# EAGLE design buffered mult rt1_postpwer (EAGLE 7.3.0)

## Sheet 1 of 2
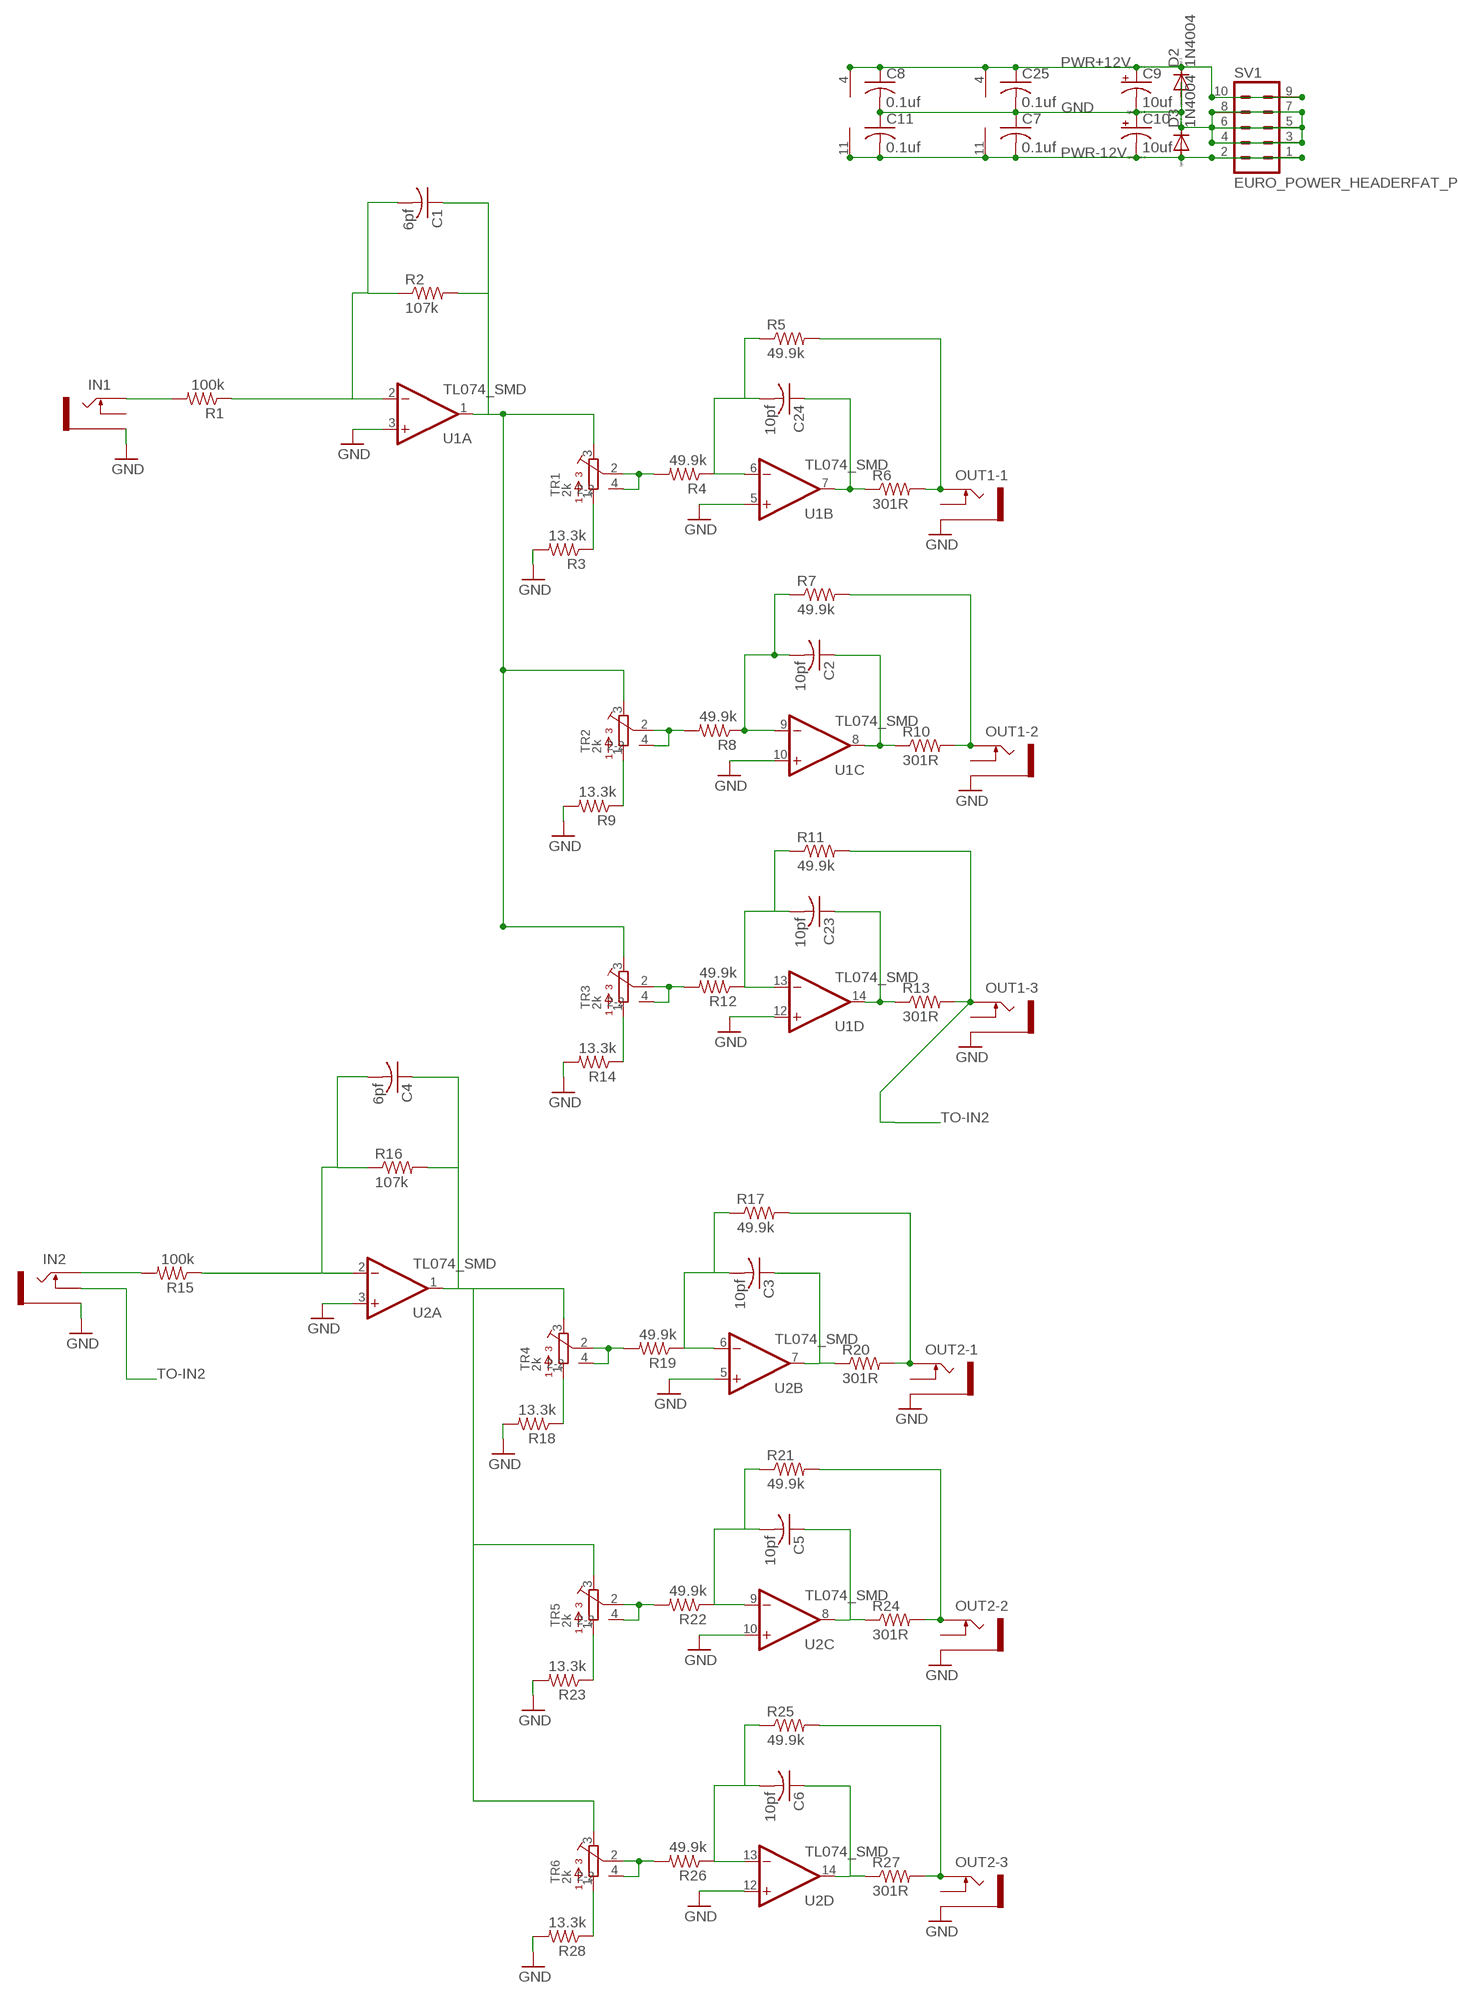
[diagram p0: schematic, sheet 1]

### Parts
C1  6pf  C-USC0603  [C0603]
C2  10pf  C-USC0603  [C0603]
C3  10pf  C-USC0603  [C0603]
C4  6pf  C-USC0603  [C0603]
C5  10pf  C-USC0603  [C0603]
C6  10pf  C-USC0603  [C0603]
C7  0.1uf  C-USC0603  [C0603]
C8  0.1uf  C-USC0603  [C0603]
C9  10uf  CPOL-US153CLV-0505  [153CLV-0505]
C10  10uf  CPOL-US153CLV-0505  [153CLV-0505]
C11  0.1uf  C-USC0603  [C0603]
C23  10pf  C-USC0603  [C0603]
C24  10pf  C-USC0603  [C0603]
C25  0.1uf  C-USC0603  [C0603]
D2  1N4004  [DO41-10]
D3  1N4004  [DO41-10]
IN1  THONKICONNNEW  [WQP-PJ301M-12_JACK]
IN2  THONKICONNNEW  [WQP-PJ301M-12_JACK]
OUT1-1  THONKICONNNEW  [WQP-PJ301M-12_JACK]
OUT1-2  THONKICONNNEW  [WQP-PJ301M-12_JACK]
OUT1-3  THONKICONNNEW  [WQP-PJ301M-12_JACK]
OUT2-1  THONKICONNNEW  [WQP-PJ301M-12_JACK]
OUT2-2  THONKICONNNEW  [WQP-PJ301M-12_JACK]
OUT2-3  THONKICONNNEW  [WQP-PJ301M-12_JACK]
R1  100k  R-US_R0603  [R0603]
R2  107k  R-US_R0603  [R0603]
R3  13.3k  R-US_R0603  [R0603]
R4  49.9k  R-US_R0603  [R0603]
R5  49.9k  R-US_R0603  [R0603]
R6  301R  R-US_R0603  [R0603]
R7  49.9k  R-US_R0603  [R0603]
R8  49.9k  R-US_R0603  [R0603]
R9  13.3k  R-US_R0603  [R0603]
R10  301R  R-US_R0603  [R0603]
R11  49.9k  R-US_R0603  [R0603]
R12  49.9k  R-US_R0603  [R0603]
R13  301R  R-US_R0603  [R0603]
R14  13.3k  R-US_R0603  [R0603]
R15  100k  R-US_R0603  [R0603]
R16  107k  R-US_R0603  [R0603]
R17  49.9k  R-US_R0603  [R0603]
R18  13.3k  R-US_R0603  [R0603]
R19  49.9k  R-US_R0603  [R0603]
R20  301R  R-US_R0603  [R0603]
R21  49.9k  R-US_R0603  [R0603]
R22  49.9k  R-US_R0603  [R0603]
R23  13.3k  R-US_R0603  [R0603]
R24  301R  R-US_R0603  [R0603]
R25  49.9k  R-US_R0603  [R0603]
R26  49.9k  R-US_R0603  [R0603]
R27  301R  R-US_R0603  [R0603]
R28  13.3k  R-US_R0603  [R0603]
SV1  EURO_POWER_HEADERFAT_PADS  [EURO_PWR_HEADER_FAT]
TR1  2k  BOURNS_3362P_TRIMMERP  [BOURNS_3362P_TRIMMER]
TR2  2k  BOURNS_3362P_TRIMMERP  [BOURNS_3362P_TRIMMER]
TR3  2k  BOURNS_3362P_TRIMMERP  [BOURNS_3362P_TRIMMER]
TR4  2k  BOURNS_3362P_TRIMMERP  [BOURNS_3362P_TRIMMER]
TR5  2k  BOURNS_3362P_TRIMMERP  [BOURNS_3362P_TRIMMER]
TR6  2k  BOURNS_3362P_TRIMMERP  [BOURNS_3362P_TRIMMER]
U1  TL074_SMD  [SO14]
U2  TL074_SMD  [SO14]

### Nets
GND: C7.1 C8.2 C9.- C10.+ C11.1 C25.2 D2.A D3.C IN1.P$3_SLEEVE(SLEEVE) IN2.P$3_SLEEVE(SLEEVE) OUT1-1.P$3_SLEEVE(SLEEVE) OUT1-2.P$3_SLEEVE(SLEEVE) OUT1-3.P$3_SLEEVE(SLEEVE) OUT2-1.P$3_SLEEVE(SLEEVE) OUT2-2.P$3_SLEEVE(SLEEVE) OUT2-3.P$3_SLEEVE(SLEEVE) R3.2 R9.2 R14.2 R18.2 R23.2 R28.2 SV1.3 SV1.4 SV1.5 SV1.6 SV1.7 SV1.8 U1.3(A:+IN) U1.5(B:+IN) U1.10(C:+IN) U1.12(D:+IN) U2.3(A:+IN) U2.5(B:+IN) U2.10(C:+IN) U2.12(D:+IN)
N$1: IN1.P$1_TIP(TIP) R1.2
N$2: C4.1 R16.2 TR4.3 TR5.3 TR6.3 U2.1(A:OUT)
N$3: C1.2 R1.1 R2.1 U1.2(A:-IN)
N$4: C4.2 R15.1 R16.1 U2.2(A:-IN)
N$5: R18.1 TR4.1
N$6: R3.1 TR1.1
N$7: C1.1 R2.2 TR1.3 TR2.3 TR3.3 U1.1(A:OUT)
N$8: R19.2 TR4.2 TR4.4(2-2)
N$9: R4.2 TR1.2 TR1.4(2-2)
N$10: C24.2 R4.1 R5.1 U1.6(B:-IN)
N$11: C3.2 R17.1 R19.1 U2.6(B:-IN)
N$12: C24.1 R6.1 U1.7(B:OUT)
N$13: OUT1-1.P$1_TIP(TIP) R5.2 R6.2
N$14: C3.1 R20.1 U2.7(B:OUT)
N$15: R9.1 TR2.1
N$16: OUT2-1.P$1_TIP(TIP) R17.2 R20.2
N$17: R23.1 TR5.1
N$18: R22.2 TR5.2 TR5.4(2-2)
N$19: R8.2 TR2.2 TR2.4(2-2)
N$20: C2.2 R7.1 R8.1 U1.9(C:-IN)
N$21: C2.1 R10.1 U1.8(C:OUT)
N$23: C5.2 R21.1 R22.1 U2.9(C:-IN)
N$24: C5.1 R24.1 U2.8(C:OUT)
N$25: OUT1-2.P$1_TIP(TIP) R7.2 R10.2
N$26: OUT2-2.P$1_TIP(TIP) R21.2 R24.2
N$27: R28.1 TR6.1
N$28: R26.2 TR6.2 TR6.4(2-2)
N$29: C6.2 R25.1 R26.1 U2.13(D:-IN)
N$30: C6.1 R27.1 U2.14(D:OUT)
N$31: OUT2-3.P$1_TIP(TIP) R25.2 R27.2
N$41: R14.1 TR3.1
N$42: R12.2 TR3.2 TR3.4(2-2)
N$43: C23.2 R11.1 R12.1 U1.13(D:-IN)
PWR+12V: C8.1 C9.+ C25.1 D2.C SV1.9 SV1.10 U1.4(P:V+) U2.4(P:V+)
PWR-12V: C7.2 C10.- C11.2 D3.A SV1.1 SV1.2 U1.11(P:V-) U2.11(P:V-)
TO-IN2: C23.1 IN2.P$2_SWITCH(SWITCH) OUT1-3.P$1_TIP(TIP) R11.2 R13.1 R13.2 U1.14(D:OUT)
TO-IN3: IN2.P$1_TIP(TIP) R15.2
Unconnected: IN1.P$2_SWITCH(SWITCH) OUT1-1.P$2_SWITCH(SWITCH) OUT1-2.P$2_SWITCH(SWITCH) OUT1-3.P$2_SWITCH(SWITCH) OUT2-1.P$2_SWITCH(SWITCH) OUT2-2.P$2_SWITCH(SWITCH) OUT2-3.P$2_SWITCH(SWITCH)

## Sheet 2 of 2

## Library data of the parts
C1-C8 C11 C23-C25 = resistor:C-US: CAPACITOR, American symbol
C9 C10 = resistor:CPOL-US: POLARIZED CAPACITOR, American symbol
D2 D3 = diode:1N4004: DIODE general purpose rectifier, 1 A
IN1 IN2 OUT1-1-OUT1-3 OUT2-1-OUT2-3 = MusicThingModular:THONKICONN: 3.5mm socket for Eurorack modular synths
R1-R28 = resistor:R-US_: RESISTOR, American symbol
SV1 = MusicThingModular:EURO_POWER_HEADER: Power Header 10 pin power header for Eurorack Power Supplies Variants with fatter pads for easier soldering, and the LOCK variant which has 5mil offset pins to hold the component in place before soldering
TR1-TR6 = MusicThingModular:BOURNS_3362P_TRIMMER: 3362 Series 1/4" Square Trimmer
U1 U2 = MusicThingModular:TL074: Generic Quad Op Amp

## Board
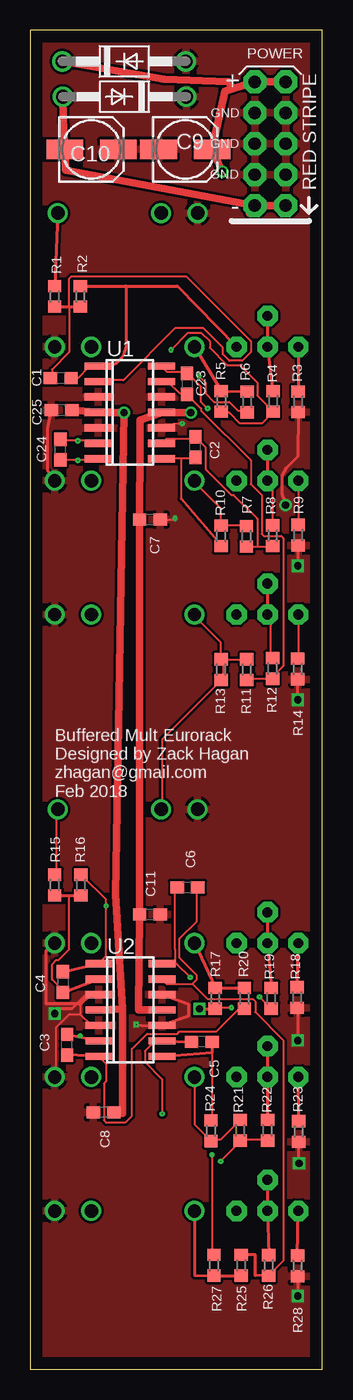
[diagram p1: board, top side]
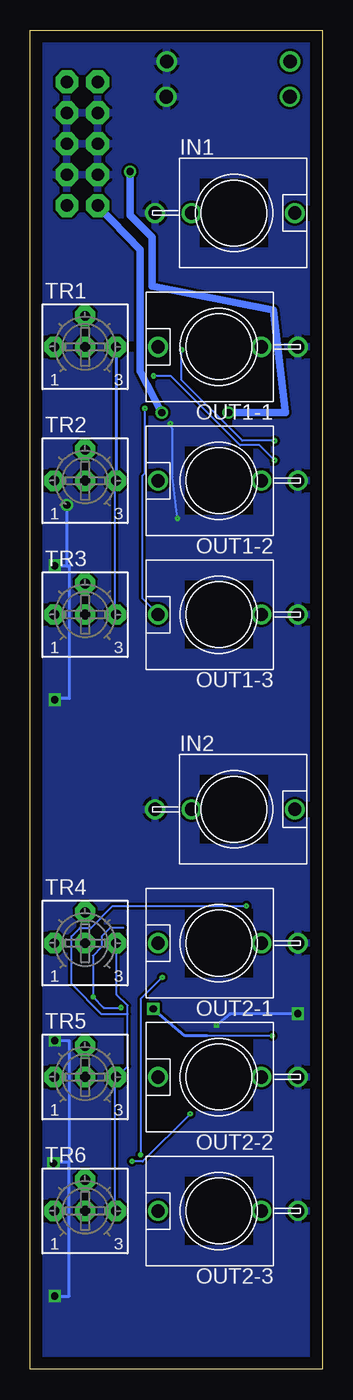
[diagram p2: board, bottom side, seen from below]

Size 24 x 110 mm. Coordinates in mm from the lower left corner, seen from the top.
Outline: 0,0 24,0 24,110 0,110 0,0
Copper layers (1*16): Top 0.035mm / dielectric 1.5mm / Bottom 0.035mm
Design rules "default *": minimum track width 6mil, minimum drill 1mil, track to track 8mil, track to pad 8mil, pad to pad 8mil, via to via 8mil, smd to smd 8mil, copper to edge 40mil, drill to drill 8mil, minimum pad ring 10mil, minimum via ring 8mil, stop-mask expansion 4mil, vias tented up to drill 0mil, thermal gap 10mil

### Footprints (pad centres in the part's own frame; a part is rotated, then mirrored left to right if it is on the bottom)
C0603 = smd 1.1 x 1: 1 -0.85,0; 2 0.85,0
153CLV-0505 = smd 3 x 1.6: + 2.2,0; - -2.2,0
DO41-10 = drill 1.118: A 5.08,0; C -5.08,0
WQP-PJ301M-12_JACK = drill 1.1: P$1_TIP 0,5; P$2_SWITCH 0,-3.5; P$3_SLEEVE 0,-6.5
R0603 = smd 1 x 1.1: 1 -0.85,0; 2 0.85,0
EURO_PWR_HEADER_FAT = drill 1.016 pad 1.88 octagon: 1 -5.08,-1.27; 2 -5.08,1.27; 3 -2.54,-1.27; 4 -2.54,1.27; 5 0,-1.27; 6 0,1.27; 7 2.54,-1.27; 8 2.54,1.27; 9 5.08,-1.27; 10 5.08,1.27
BOURNS_3362P_TRIMMER = drill 0.813 pad 1.676 octagon: 1 -2.54,0; 2 0,2.54; 3 2.54,0; 4 0,0
SO14 = smd 0.6 x 2.2: 1 -3.81,-2.6; 2 -2.54,-2.6; 3 -1.27,-2.6; 4 0,-2.6; 5 1.27,-2.6; 6 2.54,-2.6; 7 3.81,-2.6; 8 3.81,2.6; 9 2.54,2.6; 10 1.27,2.6; 11 0,2.6; 12 -1.27,2.6; 13 -2.54,2.6; 14 -3.81,2.6

### Placement (x,y rotation side)
C1  2.5,81.42 180 top
C2  13.57,75.76 90 top
C3  3.02,26.65 90 top
C4  2.68,31.8 270 top
C5  14.1,26.9 180 top
C6  12.92,39.58 0 top
C7  9.83,69.8 180 top
C8  6.03,21.1 180 top
C9  12.74,100.22 0 top
C10  5.02,100.22 0 top
C11  9.83,37.35 180 top
C23  12.88,80.96 270 top
C24  2.47,75.56 90 top
C25  2.58,78.8 180 top
D2  7.71,107.45 0 top
D3  7.74,104.55 180 top
IN1  7.25,95 270 bottom
IN2  7.25,46 270 bottom
OUT1-1  8.5,84 90 bottom
OUT1-2  8.5,73 90 bottom
OUT1-3  8.5,62 90 bottom
OUT2-1  8.5,35 90 bottom
OUT2-2  8.5,24 90 bottom
OUT2-3  8.5,13 90 bottom
R1  2,88.14 90 top
R2  4.12,88.14 90 top
R3  22.02,79.48 270 top
R4  19.96,79.52 90 top
R5  15.71,79.52 90 top
R6  17.83,79.47 90 top
R7  17.77,68.43 90 top
R8  19.92,68.48 90 top
R9  22.03,68.52 270 top
R10  15.68,68.47 90 top
R11  17.8,57.47 90 top
R12  19.91,57.57 90 top
R13  15.68,57.47 90 top
R14  21.99,57.53 270 top
R15  2,39.77 90 top
R16  4.15,39.77 90 top
R17  15.21,30.47 90 top
R18  21.94,30.53 270 top
R19  19.81,30.47 90 top
R20  17.6,30.47 90 top
R21  17.26,19.62 90 top
R22  19.5,19.62 90 top
R23  22.07,19.53 270 top
R24  14.85,19.58 270 top
R25  17.35,8.53 270 top
R26  19.6,8.52 90 top
R27  15.1,8.53 270 top
R28  21.97,8.48 270 top
SV1  19.73,100.69 90 top
TR1  19.5,84 0 bottom
TR2  19.5,73 0 bottom
TR3  19.5,62 0 bottom
TR4  19.5,35 0 bottom
TR5  19.5,24 0 bottom
TR6  19.5,13 0 bottom
U1  8.18,78.61 270 top
U2  8.23,29.51 270 top

### Tracks (layer width: path | path; a pad name or v marks a point on that pad's centre or on a via)
GND  (via drill 0.03, 0.6)
  Top 0.152: 4.09,29.16 4.98,28.27 5.51,28.27 U2.5 | 4.09,29.16 4.09,29.87 4.98,30.76 5.51,30.76 U2.3 | 4.09,29.16 3.2,29.16 2.13,28.09 2.13,24 OUT2-2.P$3_SLEEVE | 4.45,80.01 4.45,79.88 | v12.5,77.7 11.04,77.6 U1.10 | C7.1 11.8,69.8 v11.9,69.9
  Top 0.254: C25.2 1.4,77.3 1.4,73.9 OUT1-2.P$3_SLEEVE | R3.2 22,75 21,74 20.7,73.4 20.7,71.9 v21,71 | v22,66 22.03,66 R9.2 | v22,55 v21.99,55 R14.2 | R18.2 22,29.68 v22,27 | v22.1,16.9 22.07,16.9 R23.2 | R28.2 22,7.63 v22,6 | OUT2-1.P$3_SLEEVE 1.3,34.4 1.3,30 4,30 4.78,30.78 U2.3 5.61,30.8 4.6,30.8 3.4,29.6 2.4,29.6 v2,29.2 | U2.12 13,30 13,29 U2.10 10.69,28.1 v8.7,28.3
  Bottom 0.152: v11.9,69.9 12.3,73.3 12.3,77.2 v12.5,77.7
  Bottom 0.254: v21,71 21,66 | 21,66 v22,66 | 21,66 20.8,66 20.8,55.1 22,55.1 v22,55 | v22,27 20.8,27 20.8,17 | 20.8,17 22.1,17 v22.1,16.9 | v22,6 20.8,6 20.8,17 | v2,29.2 7.6,29.2 v8.7,28.3
  pour Bottom: 0,112 -1,112 -1,-3 25,-3 25,-2 25,112
  pour Top: 0,111 0,0 24,0 24,111
N$1
  Top 0.254: IN1.P$1_TIP R1.2
N$2  (via drill 0.03)
  Top 0.152: R16.2 4.27,40.54 6.22,38.58 v6.22,38.05 6.22,33.96 5.69,33.43 U2.1
  Top 0.254: C4.1 U2.1
  Bottom 0.152: TR6.3 17.07,13.16 17.07,23.82 TR5.3 16.89,24 16,24.89 16,29.16 | 16,29.16 16,29.87 16.89,30.76 16.89,34.85 TR4.3 | v6.22,38.05 17.25,38.05 19.02,36.27 19.91,36.27 20.62,35.56 20.62,31.65 18.14,29.16 16,29.16
N$3
  Top 0.152: C1.2 1.78,81.43 1.78,82.14 3.2,83.57 3.2,87.29 3.2,89.61 3.38,89.79 12.8,89.79 18.14,84.45 18.14,83.57 17.42,82.86 16.36,82.86 15.82,83.39 15.82,83.92 14.22,85.52 11.91,85.52 7.64,81.25 5.69,81.25 U1.2
  Top 0.254: R1.1 3.2,87.29 R2.1
N$4
  Top 0.152: 3.2,38.94 3.2,38.92 3.2,34.49 2.31,33.6 2.13,33.6 1.78,33.25 1.78,32 2.67,31.11 C4.2
  Top 0.254: C4.2 U2.2 | R15.1 3.2,38.92 R16.1
N$5
  Top 0.254: R18.1 TR4.1
N$6
  Top 0.254: TR1.1 R3.1
N$7
  Top 0.152: C1.1 3.38,81.43 3.91,81.43 4.8,82.32 5.51,82.32 U1.1
  Top 0.254: R2.2 7.8,89 | 7.8,89 12.1,89 TR1.3 | 4.8,82.32 5.92,82.32 arc90 7.9,84.3 7.9,88.89 arc90 7.8,89
  Bottom 0.152: TR3.3 17.07,62.05 17.07,72.9 TR2.3
  Bottom 0.254: TR1.3 TR2.3
N$8
  Top 0.254: TR4.2 TR4.4 R19.2
N$9
  Top 0.254: TR1.2 TR1.4 R4.2
N$10  (via drill 0.03)
  Top 0.152: R5.1 15.82,78.59 16.36,78.59 17.25,77.7 19.02,77.7 19.91,78.59 R4.1 19.91,78.77 18.67,80.01 18.67,81.08 17.25,82.5 16.18,82.5 14.76,83.92 14.76,84.45 14.05,85.17 12.98,85.17 v11.56,83.74 | C24.2 2.49,76.28 v3.91,76.28 5.33,76.28 5.51,76.1 U1.6
  Bottom 0.152: v11.56,83.74 11.56,81.25 6.58,76.28 v3.91,76.28
N$11  (via drill 0.03, 0.6)
  Top 0.152: v16.54,29.69 15.29,29.69 R17.1 | v18.85,30.58 19.74,29.69 R19.1 | v4.09,27.38 4.07,27.29
  Top 0.254: C3.2 4.07,27.29 U2.6 | v13.9,29.6 15.19,29.6 R17.1
  Bottom 0.152: v16.54,29.69 17.96,29.69 v18.85,30.58 18.85,33.96 18.14,34.67 18.14,35.56 17.42,36.27 16.36,36.27 | v4.09,27.38 9.47,27.38
  Bottom 0.254: 9.47,27.38 11.28,27.38 v13.9,29.6
N$12  (via drill 0.03)
  Top 0.152: C24.1 2.49,74.68 v3.91,74.68 5.51,74.68 U1.7 | v13.87,81.61 14.4,81.08 14.4,80.19 15.11,79.48 16.36,79.48 17.07,78.77 17.78,78.77 R6.1
  Bottom 0.152: v13.87,81.61 12.45,81.61 6.76,75.92 5.16,75.92 v3.91,74.68
N$13
  Top 0.254: OUT1-1.P$1_TIP R5.2 R6.2
N$14
  Top 0.152: R20.1 17.42,29.52 17.07,29.52 15.29,27.74 12.27,27.74 12.09,27.56 9.6,27.56 8.36,26.31 8.36,20.8 7.82,20.27 6.22,20.27 6.04,20.45 6.04,23.47 6.22,23.65 6.22,25.07 5.69,25.6 U2.7
  Top 0.254: U2.7 C3.1
N$15
  Top 0.152: R9.1 22.05,69.52 22.05,72.9 TR2.1
N$16
  Top 0.254: OUT2-1.P$1_TIP R17.2 R20.2
N$17
  Top 0.254: R23.1 TR5.1
N$18
  Top 0.254: TR5.2 TR5.4 R22.2
N$19
  Top 0.152: R8.2 19.91,69.34 19.91,72.54 19.56,72.9 TR2.4
  Top 0.254: TR2.2 TR2.4
N$20
  Top 0.152: 18.67,67.56 19.91,67.56 R8.1 | 18.67,67.56 17.78,67.56 R7.1 | U1.9 10.85,76.1 11.2,76.45 13.51,76.45 C2.2 13.69,76.45 14.4,75.74 14.4,73.97 16.54,71.83 16.71,71.83 18.67,69.88 18.67,67.56
N$21
  Top 0.152: 12.37,74.85 10.85,74.85 U1.8 | 12.37,74.85 13.51,74.85 C2.1 | 12.37,74.85 12.37,71.52 15.65,67.74 R10.1
N$23  (via drill 0.03)
  Top 0.152: R22.1 19.38,18.85 17.42,18.85 R21.1 17.25,18.67 v15.65,17.07 | v10.85,20.98 10.85,23.82 9.42,25.25 9.42,26.14 10.13,26.85 10.67,26.85 U2.9
  Top 0.254: U2.9 C5.2
  Bottom 0.152: v15.65,17.07 14.76,17.07 v10.85,20.98
N$24
  Top 0.152: R24.1 14.94,20.45 14.94,25.96 14.93,26.01
  Top 0.254: C5.1 14.96,26.01 14.93,26.01 U2.8
N$25
  Top 0.152: R7.2 17.6,69.34 15.82,69.34 R10.2 15.65,69.34 15.65,70.76 13.51,72.9 OUT1-2.P$1_TIP
N$26
  Top 0.152: R21.2 17.25,20.45 15.65,18.85 14.94,18.85 R24.2 14.76,18.85 13.51,20.09 13.51,23.82 OUT2-2.P$1_TIP
N$27
  Top 0.254: R28.1 TR6.1
N$28
  Top 0.254: TR6.2 TR6.4 R26.2
N$29
  Top 0.152: 13.34,31.65 13.69,32 13.69,32.36 12.27,33.78 12.27,35.38 13.69,36.8 13.69,39.47 C6.2 | 13.34,31.65 11.2,31.65 10.85,32 U2.13 | 13.34,31.65 14.58,30.4 18.31,30.4 18.49,30.23 18.49,29.34 20.8,27.03 20.8,8.89 19.74,7.82 R26.1
  Top 0.254: R26.1 18.5,7.7 18.5,9.4 R25.1
N$30  (via drill 0.03)
  Top 0.152: C6.1 11.91,39.47 11.91,34.49 11.9,34.49 11.9,33.3 | 10.85,33.43 U2.14 10.83,33.3 11.9,33.3 | v14.94,17.6 14.94,9.42 R27.1 | 11.9,33.3 12.04,33.3 v13.16,32.18
  Bottom 0.152: v14.94,17.6 14.94,30.4 v13.16,32.18
N$31
  Top 0.254: R25.2 R27.2 13.5,7.7 OUT2-3.P$1_TIP
N$41
  Top 0.152: R14.1 22.05,58.5 22.05,61.87 TR3.1
N$42
  Top 0.152: R12.2 19.74,58.5 19.74,61.7 19.56,61.87 TR3.4
  Top 0.254: TR3.2 TR3.4
N$43
  Top 0.152: R11.1 17.96,56.72 19.74,56.72 R12.1 19.91,56.9 20.8,57.78 20.8,68.28 20.62,68.45 19.2,68.45 19.02,68.63 19.02,71.83 18.14,72.72 18.14,74.68 14.05,78.77 14.05,78.94 12.98,80.01 C23.2 12.8,80.19 12.27,80.19 11.38,81.08 10.85,81.08 U1.13
PWR+12V  (via drill 0.6)
  Top 0.152: 5.32,78.63 5.33,78.77 U1.4
  Top 0.61: SV1.9 SV1.10 16.66,105.2 | 16.66,105.2 16,105 C9.+ v15.8,98.4 | D2.C 11,106 16.3,105.8 16.66,105.2 | U1.4 v7.7,78.6 7,39 7.6,29.6 | C25.1 5.32,78.63 5.6,78.6 | U2.4 7.6,29.6 | 7.6,29.6 7.6,21 C8.1
  Bottom 0.61: v15.8,98.4 15.8,94.8 14,93 14,89 4,87 3.03,78.6 v7.7,78.6
PWR-12V  (via drill 0.6)
  Top 0.61: SV1.1 SV1.2 | SV1.2 18,95.61 18,95 18.46,95 SV1.2 | D3.A 2.7,102.8 C10.- 2.9,98.5 SV1.2 | v13.2,78.6 U1.11 9,78 9,76 C7.2 C11.2 8.9,29.5 10.1,29.5 U2.11
  Bottom 0.61: v13.2,78.6 15,82 15,92 SV1.2
TO-IN2  (via drill 0.03)
  Top 0.152: U1.14 10.85,82.32 11.2,81.97 12.8,81.97 C23.1 12.98,81.79 14.05,80.72 14.05,79.48 v14.58,78.94 | 15.82,58.32 15.82,56.72 R13.1 15.65,56.54 10.85,51.74 10.85,46.05 IN2.P$2_SWITCH | 15.82,58.32 17.78,58.32 R11.2 | 15.82,58.32 R13.2 15.65,58.5 15.65,59.74 13.51,61.87 OUT1-3.P$1_TIP
  Bottom 0.152: v14.58,78.94 14.58,73.61 14.76,73.43 14.76,63.3 13.51,62.05 OUT1-3.P$1_TIP
TO-IN3
  Top 0.152: R15.2 2.13,40.72 2.13,45.87 IN2.P$1_TIP

### Text on the board
tNames: Buffered Mult Eurorack / Designed by Zack Hagan / zhagan@gmail.com / Feb 2018